# Altium project SS-PowerV3.0.PrjPcb
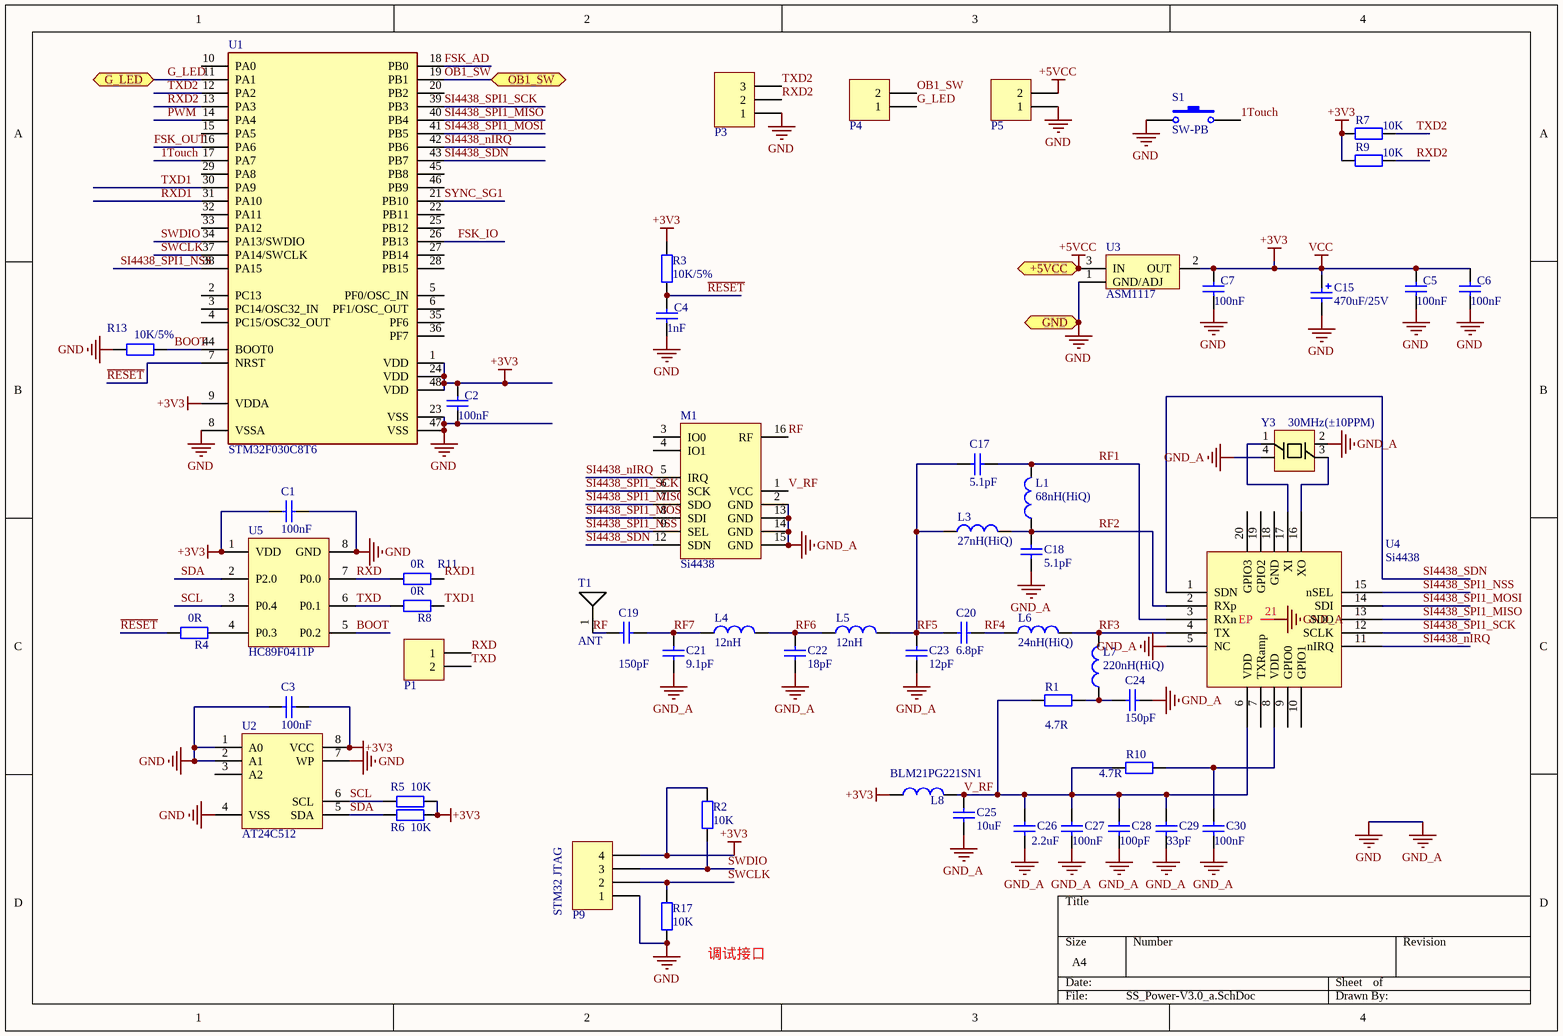
[diagram p0: SS_Power-V3.0_a.SchDoc]
1 sheet, 56 parts. Net scope: flat (ports and power ports of the same name join across sheets).
Board file: SS_Power-V3.0_a.PcbDoc

## Sheet SS_Power-V3.0_a.SchDoc
size A4

### Parts
C1  100nF  [C-RAD-0603]
C2  100nF  [C-RAD-0603]
C3  100nF  [C-RAD-0603]
C4  1nF  [C0402]
C5  100nF  [C-RAD-0603]
C6  100nF  [C-RAD-0603]
C7  100nF  [C-RAD-0603]
C15  470uF/25V  [C-RB-5/2]
C17  5.1pF  [C0402]
C18  5.1pF  [C0402]
C19  150pF  [C0402]
C20  6.8pF  [C0402]
C21  9.1pF  [C0402]
C22  18pF  [C0402]
C23  12pF  [C0402]
C24  150pF  [C0402]
C25  10uF  [C0603]
C26  2.2uF  [C0603]
C27  100nF  [C0402]
C28  100pF  [C0402]
C29  33pF  [C0402]
C30  100nF  [C0402]
L1  68nH(HiQ)  [0402]
L3  27nH(HiQ)  [0402]
L4  12nH  [0402]
L5  12nH  [0402]
L6  24nH(HiQ)  [0402]
L7  220nH(HiQ)  [0402]
L8  BLM21PG221SN1  [0805-1]
M1  Si4438  [HPD01]
P1  Header 2  [hdr1.27x2_host]  (value not drawn)
P3  Header 3  [HDR3X1/1.25]  (value not drawn)
P4  Header 2  [HDR2X1_2.0]  (value not drawn)
P5  Header 2  [HDR2X1_2.0]  (value not drawn)
P9  Header 4  [HDR4X1/1.25B2M]  (value not drawn)
R1  4.7R  [R0402]
R2  10K  [R0402]
R3  10K/5%  [R0402]
R4  0R  [R0402]
R5  10K  [R0402]
R6  10K  [R0402]
R7  10K  [R0402]
R8  0R  [R0402]
R9  10K  [R0402]
R10  4.7R  [R0402]
R11  0R  [R0402]
R13  10K/5%  [R0402]
R17  10K  [R0402]
S1  SW-PB  [swich_micro]
T1  ANT  [ANT470]
U1  STM32F030C8T6  [LQFP48_7X7X05P]
U2  AT24C512  [SOIC8_N]
U3  ASM1117  [SOT-223]
U4  Si4438  [QFN20/0.5]
U5  HC89F0411P  [SO-8]
Y3  30MHz(±10PPM)  [XTAL4/3.2X2.5/S]

### Ports
+5VCC, G_LED, GND, OB1_SW

### Nets
+3V3: C1.2 C2.2 C3.1 C5.2 C6.2 C7.2 C15.1 L8.1 P9.4 R2.1 R3.2 R5.2 R6.2 R7.1 R9.1 U1.1(VDD) U1.9(VDDA) U1.24(VDD) U1.48(VDD) U2.8(VCC) U3.2(OUT) U5.1(VDD)  [also labelled VCC]
+5VCC: P5.2 U3.3(IN) ; port +5VCC
GND: C1.1 C2.1 C3.2 C4.1 C5.1 C6.1 C7.1 C15.2 C18.2 C21.1 C22.1 C23.1 C24.1 C25.1 C26.1 C27.1 C28.1 C29.1 C30.1 M1.2(GND) M1.13(GND) M1.14(GND) M1.15(GND) P3.1 P5.1 P9.1 R13.1 R17.2 S1.1 U1.8(VSSA) U1.23(VSS) U1.47(VSS) U2.1(A0) U2.2(A1) U2.4(VSS) U2.7(WP) U3.1(GND/ADJ) U4.5(NC) U4.21(EP) U5.8(GND) Y3.2 Y3.4 ; port GND  [also labelled GND_A]
1Touch: S1.2 U1.17(PA7)
BOOT: R13.2 U1.44(BOOT0) U5.5(P0.2)
FSK_AD: U1.18(PB0)
FSK_IO: U1.26(PB13)
FSK_OUT: U1.16(PA6)
G_LED: P4.1 U1.11(PA1) ; port G_LED
OB1_SW: P4.2 U1.19(PB1) ; port OB1_SW
PWM: U1.14(PA4)
~{RESET}: C4.2 R3.1 R4.1 U1.7(NRST)
RF: C19.1 M1.16(RF) T1.1
RF1: C17.2 L1.2 U4.3(RXn)
RF2: C18.1 L1.1 L3.2 U4.2(RXp)
RF3: L6.2 L7.2 U4.4(TX)
RF4: C20.1 L6.1
RF5: C17.1 C20.2 C23.2 L3.1 L5.2
RF6: C22.2 L4.2 L5.1
RF7: C19.2 C21.2 L4.1
RXD: P1.1 R11.1 U5.7(P0.0)
RXD1: R11.2 U1.31(PA10)
RXD2: P3.2 R9.2 U1.13(PA3)
SCL: R5.1 U2.6(SCL) U5.3(P0.4)
SDA: R6.1 U2.5(SDA) U5.2(P2.0)
SI4438_nIRQ: M1.5(IRQ) U1.42(PB6) U4.11(nIRQ)
SI4438_SDN: M1.12(SDN) U1.43(PB7) U4.1(SDN)
SI4438_SPI1_MISO: M1.7(SDO) U1.40(PB4) U4.13(SDO)
SI4438_SPI1_MOSI: M1.8(SDI) U1.41(PB5) U4.14(SDI)
SI4438_SPI1_NSS: M1.9(SEL) U1.38(PA15) U4.15(nSEL)
SI4438_SPI1_SCK: M1.6(SCK) U1.39(PB3) U4.12(SCLK)
SWCLK: P9.2 R17.1 U1.37(PA14/SWCLK)
SWDIO: P9.3 R2.2 U1.34(PA13/SWDIO)
SYNC_SG1: U1.21(PB10)
TXD: P1.2 R8.1 U5.6(P0.1)
TXD1: R8.2 U1.30(PA9)
TXD2: P3.3 R7.2 U1.12(PA2)
V_RF: C25.2 C26.2 C27.2 C28.2 C29.2 L8.2 M1.1(VCC) R1.1 R10.1 U4.6(VDD)
NetC24_2: C24.2 L7.1 R1.2
NetC30_2: C30.2 R10.2 U4.8(VDD)
NetR4_2: R4.2 U5.4(P0.3)
NetU4_16: U4.16(XO) Y3.3
NetU4_17: U4.17(XI) Y3.1

Not connected (* = marked no-connect by the designer): M1 3(IO0) 4(IO1); U1 2(PC13) 3(PC14/OSC32_IN) 4(PC15/OSC32_OUT) 5(PF0/OSC_IN) 6(PF1/OSC_OUT) 10(PA0) 15(PA5) 20(PB2) 22(PB11) 25(PB12) 27(PB14) 28(PB15) 29(PA8) 32(PA11) 33(PA12) 35(PF6) 36(PF7) 45(PB8) 46(PB9); U2 3(A2); U4 7(TXRamp) 9(GPIO0) 10(GPIO1) 18(GND) 19(GPIO2) 20(GPIO3)

### Notes on the sheet
- (near P9) STM32 JTAG
- (near R17) 调试接口

### Library data of the parts
C1-C3 C5-C7 C27 C30 = Cap: 无极性电容; Published: 8-Jun-2000; LatestRevisionDate: 17-Jul-2002; LatestRevisionNote: Re-released for DXP Platform.; PackageReference: RAD-0.3; Publisher: Altium Limited; Value: 100nF
C4 C17-C26 C28 C29 = Cap: 无极性电容; Value: 100nF; Published: 8-Jun-2000; LatestRevisionDate: 17-Jul-2002; LatestRevisionNote: Re-released for DXP Platform.; PackageReference: RAD-0.3; Publisher: Altium Limited
C15 = CAP3: 电解电容; PackageReference: RB7.6-15
L1 L3-L7 = Inductor: 电感; Code_IEC: 1005; Value: 10uH; Published: 8-Jun-2000; LatestRevisionDate: 17-Jul-2002; LatestRevisionNote: Re-released for DXP Platform.; PackageReference: 0402-A; Publisher: Altium Limited; Code_JEITA: 0402
L8 = Inductor: 电感; Code_IEC: 1005; Published: 8-Jun-2000; LatestRevisionDate: 17-Jul-2002; LatestRevisionNote: Re-released for DXP Platform.; PackageReference: 0402-A; Publisher: Altium Limited; Code_JEITA: 0402; Value: BLM21PG221SN1
M1 = SI4438-HPD07: SI4438模块
P1 P4 P5 = Header 2: 接插件; LatestRevisionDate: 17-Jul-2002; LatestRevisionNote: Re-released for DXP Platform.; Publisher: Altium Limited
P3 = Header 3: 接插件; LatestRevisionDate: 17-Jul-2002; LatestRevisionNote: Re-released for DXP Platform.; Publisher: Altium Limited
P9 = Header 4: 接插件; LatestRevisionDate: 17-Jul-2002; LatestRevisionNote: Re-released for DXP Platform.; Publisher: Altium Limited
R1 R3 R4 R7-R11 R13 = Res1: 电阻; Value: 1K; Published: 8-Jun-2000; LatestRevisionDate: 17-Jul-2002; LatestRevisionNote: Re-released for DXP Platform.; PackageReference: AXIAL-0.4; Publisher: Altium Limited
R2 R5 R6 R17 = Res1: 电阻; Value: 0R; Published: 8-Jun-2000; LatestRevisionDate: 17-Jul-2002; LatestRevisionNote: Re-released for DXP Platform.; PackageReference: AXIAL-0.4; Publisher: Altium Limited
S1 = SW-PB: 微动开关; Published: 24-Mar-1999; LatestRevisionDate: 17-Jul-2002; LatestRevisionNote: Re-released for DXP Platform.; PackageReference: SPST-2; Publisher: Altium Limited
T1 = ANT: 470M弹簧天线
U1 = STM32F030C8T6: MCU
U2 = AT24C02: EEROM存储器
U4 = Si4438: 无线收发器
U5 = HC89F0411P: 芯圣8脚51单片机
Y3 = XTAL_4: 四脚无源